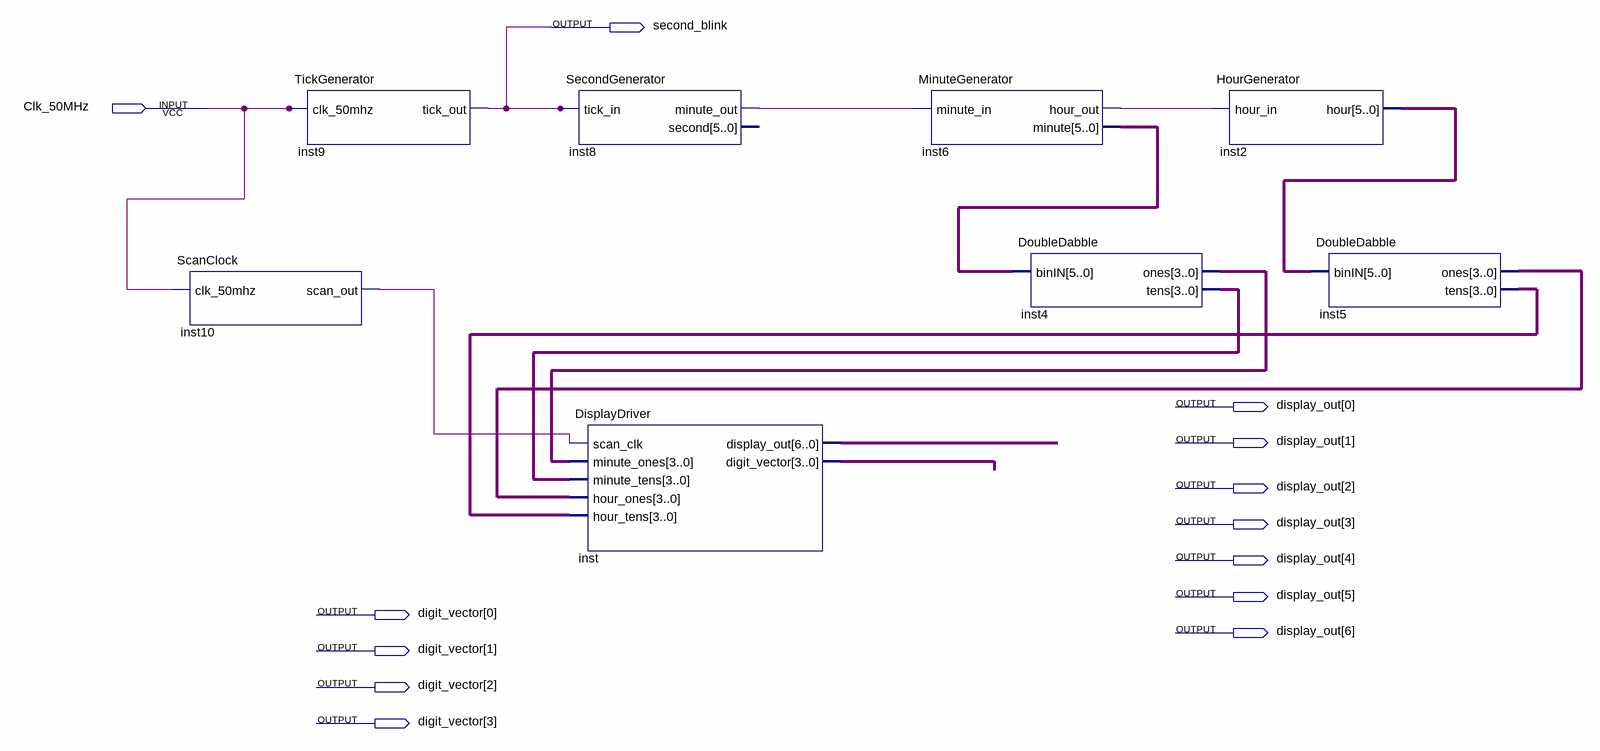
[diagram p0: schematic sheet]
// Quartus schematic Complete_Clock.bdf as structural Verilog: 8 symbols, 13 pins
module Complete_Clock (
  input  Clk_50MHz,
  output second_blink,
  output [6:0] display_out,
  output [3:0] digit_vector
);

  wire inst6_hour_out, inst8_minute_out, inst10_scan_out;
  wire [3:0] inst4_ones, inst4_tens, inst5_ones, inst5_tens, inst_digit_vector;
  wire [5:0] inst2_hour, inst6_minute;
  wire [6:0] inst_display_out;

  ScanClock inst10 (.clk_50mhz(Clk_50MHz), .scan_out(inst10_scan_out));
  TickGenerator inst9 (.clk_50mhz(Clk_50MHz), .tick_out(second_blink));
  SecondGenerator inst8 (.tick_in(second_blink), .minute_out(inst8_minute_out));  // open: second
  DisplayDriver inst (
    .scan_clk(inst10_scan_out), .minute_ones(inst4_ones), .minute_tens(inst4_tens), .hour_ones(inst5_ones),
    .hour_tens(inst5_tens), .display_out(inst_display_out), .digit_vector(inst_digit_vector));
  MinuteGenerator inst6 (.minute_in(inst8_minute_out), .hour_out(inst6_hour_out), .minute(inst6_minute));
  DoubleDabble inst4 (.binIN(inst6_minute), .ones(inst4_ones), .tens(inst4_tens));
  HourGenerator inst2 (.hour_in(inst6_hour_out), .hour(inst2_hour));
  DoubleDabble inst5 (.binIN(inst2_hour), .ones(inst5_ones), .tens(inst5_tens));
endmodule
